# Altium schematic sheet ingress.SchDoc: Power Ingress
size Letter; CheckedBy: J. Brinton; CompanyName: Signal Laboratories, Inc.; DrawnBy: J. Brinton; Engineer: J. Brinton; Address1: 3479 Edison Way; Address2: Menlo Park CA 94025; Address3: +1 (877) 778-8435; Address4: siglabs.com; Revision: 3; SheetNumber: 46; SheetTotal: 49
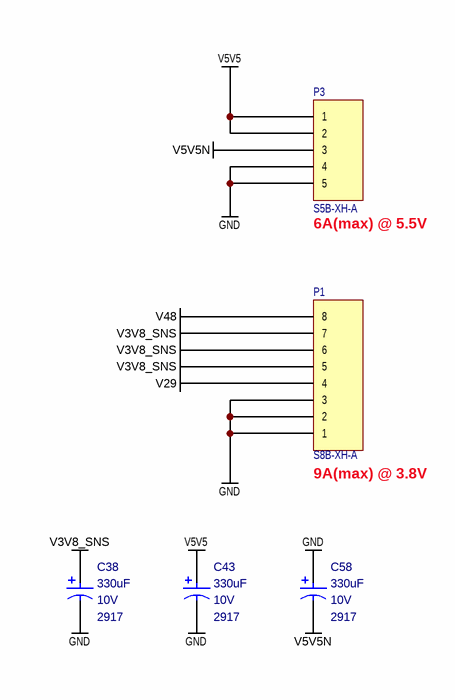
[diagram p0: ingress.SchDoc]

## Parts
C38  value 330uF  Package: 2917  Voltage: 10V  [CAPPM730X435X310L135X240N]  (hidden comment: TPSE337K010R0050)
C43  value 330uF  Package: 2917  Voltage: 10V  [CAPPM730X435X310L135X240N]  (hidden comment: TPSE337K010R0050)
C58  value 330uF  Package: 2917  Voltage: 10V  [CAPPM730X435X310L135X240N]  (hidden comment: TPSE337K010R0050)
P1  S8B-XH-A  [S8B-XH-A]
P3  S5B-XH-A  [S5B-XH-A]

## Nets
GND: C38.2 C43.2 C58.1 P1.1 P1.2 P1.3 P3.4 P3.5
V3V8_SNS: C38.1 P1.5 P1.6 P1.7
V5V5: C43.1 P3.1 P3.2
V5V5N: C58.2 P3.3
V29: P1.4
V48: P1.8

## Notes on the sheet
- (near P3) 6A(max) @ 5.5V
- (near P1) 9A(max) @ 3.8V
- Title
- Engineer
- Revision
- Drawn By
- Checked By
- Date
- Sheet
- of

## Library data of the parts
C38 C43 C58 = CAP_POL: Tantalum Capacitor 330uF ±10% 10V 2917; Manufacturer: AVX; Tr: -55:125; Manufacturer P/N: TPSE337K010R0050; Tolerance: ±10%
P1 = S8B-XH-A: 2.5mm pitch right angle 8-position; Manufacturer: JST; Manufacturer P/N: S8B-XH-A
P3 = S5B-XH-A: 2.5mm pitch right angle 5-position; Manufacturer: JST; Manufacturer P/N: S5B-XH-A